# Altium schematic sheet BMS_Circuit.SchDoc
size B
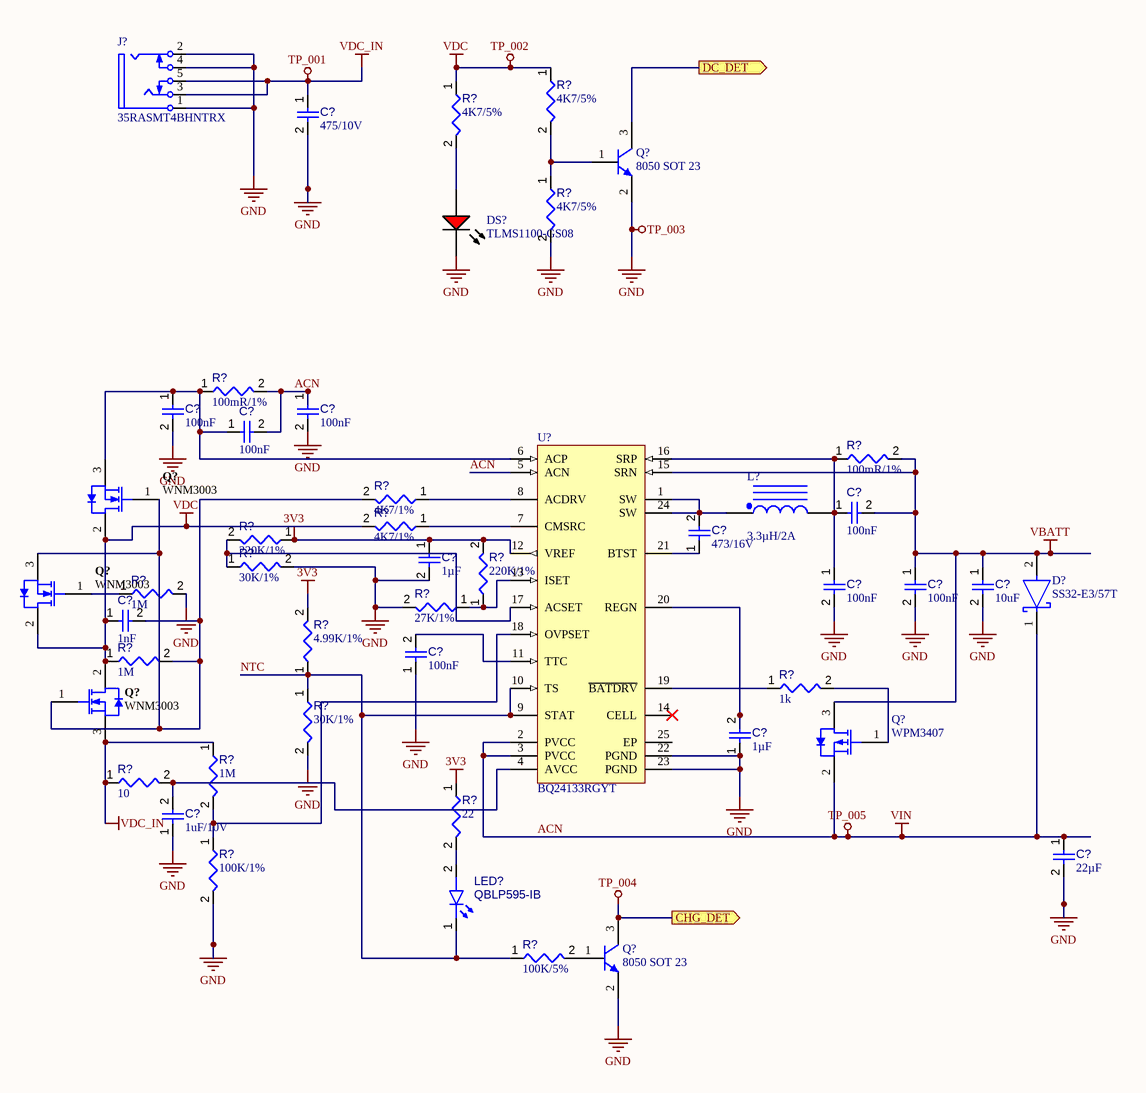
[diagram p0: BMS_Circuit.SchDoc]

## Parts
(Parts that share a designator on the sheet are numbered #1, #2 ... from top to bottom, then left to right.)
C?#1  value 475/10V  [CAPC0402(1005)60_L]  (hidden comment: Capacitor 100nF +/-20% 10V 0402)
C?#2  value 100nF  [CAPC0402(1005)60_L]  (hidden comment: Capacitor 100nF +/-20% 50V 0402)
C?#3  value 100nF  [CAPC0402(1005)60_L]  (hidden comment: Capacitor 100nF +/-20% 50V 0402)
C?#4  value 100nF  [CAPC0402(1005)60_L]  (hidden comment: Capacitor 100nF +/-20% 50V 0402)
C?#5  value 100nF  [CAPC0402(1005)60_L]  (hidden comment: Capacitor 100nF +/-20% 25V 0402)
C?#6  value 1µF  [CAPC1005X55X25ML05T10]  (hidden comment: Capacitor 1 uF +/- 10% 6.3 V 0402)
C?#7  value 473/16V  [CAPC0402(1005)60_L]  (hidden comment: Capacitor 1µF +/-20% 10V 0402)
C?#8  value 100nF  [CAPC0402(1005)60_L]  (hidden comment: Capacitor 100nF +/-20% 10V 0402)
C?#9  value 100nF  [CAPC0402(1005)60_L]  (hidden comment: Capacitor 100nF +/-20% 10V 0402)
C?#10  value 10uF  [CAPC0402(1005)60_L]  (hidden comment: Capacitor 100nF +/-20% 10V 0402)
C?#11  value 1nF  [CAPC0805(2012)145_L]  (hidden comment: Capacitor 100µF +/-20% 6.3V 0805)
C?#12  value 100nF  [CAPC0402(1005)60_L]  (hidden comment: Capacitor 100nF +/-20% 10V 0402)
C?#13  value 1µF  [CAPC0402(1005)60_L]  (hidden comment: Capacitor 1µF +/-20% 10V 0402)
C?#14  value 1uF/10V  [CAPC0402(1005)60_L]  (hidden comment: Capacitor 100nF +/-20% 10V 0402)
C?#15  value 22µF  [CAPC0805(2012)145_L]  (hidden comment: Capacitor 22µF +/-40% 16V 0805)
D?  SS32-E3/57T  [FP-SS32-E3-57T-MFG]
DS?  TLMS1100-GS08  [VISH-TLMX1100_V]
J?  35RASMT4BHNTRX  [SWIT-35RASMT4BHNTRX_V]
L?  Inductance: 3.3µH/2A  [CODA-CSAB0630-100M_V]  (hidden comment: CSAB0630-100M)
LED?  QBLP595-IB  [QTB-QBLP595_V]
Q?#1  8050 SOT 23  [ONSC-SOT-23-3-318-08_V]
Q?#2  WNM3003  [FAIR-TO-251-3]
Q?#3  WNM3003  [FAIR-TO-251-3]
Q?#4  WNM3003  [FAIR-TO-251-3]
Q?#5  WPM3407  [ONSC-SOT-23-3-318-08_V]
Q?#6  8050 SOT 23  [ONSC-SOT-23-3-318-08_V]
R?#1  value 4K7/5%  [RESC1005X40X25ML10T10]  (hidden comment: Resistor 4K7 +/-5% 0402)
R?#2  value 4K7/5%  [RESC1005X40X25ML10T10]  (hidden comment: Resistor 4K7 +/-5% 0402)
R?#3  value 4K7/5%  [RESC1005X40X25ML10T10]  (hidden comment: Resistor 4K7 +/-5% 0402)
R?#4  value 100mR/1%  [RESC0402(1005)_L]  (hidden comment: Resistor 1M +/-5 % 0402 63 mW)
R?#5  value 100mR/1%  [RESC0402(1005)_L]  (hidden comment: Resistor 1M +/-5 % 0402 63 mW)
R?#6  value 4K7/1%  [RESC0402(1005)_L]  (hidden comment: Resistor 2K37 +/-1 % 0402 63 mW)
R?#7  value 4K7/1%  [RESC0402(1005)_L]  (hidden comment: Resistor 2K37 +/-1 % 0402 63 mW)
R?#8  value 220K/1%  [RESC0402(1005)_L]  (hidden comment: Resistor 2K37 +/-1 % 0402 63 mW)
R?#9  value 30K/1%  [RESC0402(1005)_L]  (hidden comment: Resistor 2K37 +/-1 % 0402 63 mW)
R?#10  value 1M  [RESC0402(1005)_L]  (hidden comment: Resistor 1M +/-1 % 0402 63 mW)
R?#11  value 27K/1%  [RESC0402(1005)_L]  (hidden comment: Resistor 2K37 +/-1 % 0402 63 mW)
R?#12  value 220K/1%  [RESC0402(1005)_L]  (hidden comment: Resistor 2K37 +/-1 % 0402 63 mW)
R?#13  value 1M  [RESC0402(1005)_L]  (hidden comment: Resistor 1M +/-1 % 0402 63 mW)
R?#14  value 4.99K/1%  [RESC0402(1005)_L]  (hidden comment: Resistor 2K37 +/-1 % 0402 63 mW)
R?#15  value 30K/1%  [RESC0402(1005)_L]  (hidden comment: Resistor 2K37 +/-1 % 0402 63 mW)
R?#16  value 1k  [RESC0402(1005)_L]  (hidden comment: Resistor 1K +/-5 % 0402 63 mW)
R?#17  value 1M  [RESC0402(1005)_L]  (hidden comment: Resistor 1M +/-5 % 0402 63 mW)
R?#18  value 10  [RESC0402(1005)_L]  (hidden comment: Resistor 10R  +/-1 % 0402 63 mW)
R?#19  value 22  [RESC0402(1005)_L]  (hidden comment: Resistor 22R  +/-5 % 0402 63 mW)
R?#20  value 100K/1%  [RESC0402(1005)_L]  (hidden comment: Resistor 1M +/-5 % 0402 63 mW)
R?#21  value 100K/5%  [RESC0402(1005)_L]  (hidden comment: Resistor 2K37 +/-1 % 0402 63 mW)
U?  BQ24133RGYT  [RGY0024A_V]

## Ports
CHG_DET (out), DC_DET (out)

## Nets
3V3: C?#6.1 R?#8.1 R?#12.2 R?#14.2 R?#19.1 U?.12(VREF)
ACN: C?#3.1 C?#4.2 C?#15.1 D?.1(C) Q?#5.2(SOURCE) R?#4.2 U?.2(PVCC) U?.3(PVCC) U?.5(ACN)  [also labelled TP_005, VIN]
GND: C?#1.2 C?#2.2 C?#3.2 C?#6.2 C?#8.2 C?#9.2 C?#10.2 C?#12.1 C?#13.1 C?#14.1 C?#15.2 DS?.2(K) J?.1 J?.2 J?.4 Q?#1.2(E) Q?#6.2(E) R?#3.2 R?#9.2 R?#10.2 R?#11.2 R?#15.2 R?#20.2 U?.22(PGND) U?.23(PGND)  [also labelled TP_003]
TP_001: C?#1.1 J?.3 J?.5 Q?#4.3(S) R?#17.1 R?#18.1  [also labelled VDC_IN]
TP_002: C?#11.1 Q?#2.2(D) Q?#3.2(D) Q?#4.2(D) R?#1.1 R?#2.1 R?#7.2 R?#13.1  [also labelled VDC]
TP_004: Q?#6.3(C) ; port CHG_DET
VBATT: C?#5.2 C?#9.1 C?#10.1 D?.2(A) Q?#5.3(DRAIN) R?#5.2 U?.15(SRN)
DC_DET: Q?#1.3(C) ; port DC_DET
NTC: LED?.1(K) R?#14.1 R?#15.1 R?#21.1 U?.9(STAT) U?.10(TS)
NetC?#2_1: C?#2.1 C?#4.1 Q?#2.3(S) R?#4.1 U?.6(ACP)
NetC?#5_1: C?#5.1 C?#8.1 L?.2 R?#5.1 U?.16(SRP)
NetC?#7_1: C?#7.1 U?.21(BTST)
NetC?#7_2: C?#7.2 L?.1 U?.1(SW) U?.24(SW)
NetC?#11_2: C?#11.2 Q?#2.1(G) Q?#3.3(S) Q?#4.1(G) R?#6.2 R?#13.2
NetC?#12_2: C?#12.2 U?.11(TTC)
NetC?#13_2: C?#13.2 U?.20(REGN)
NetC?#14_2: C?#14.2 R?#18.2 U?.4(AVCC)
NetDS?_1: DS?.1(A) R?#2.2
NetLED?_2: LED?.2(A) R?#19.2
NetQ?#1_1: Q?#1.1(B) R?#1.2 R?#3.1
NetQ?#3_1: Q?#3.1(G) R?#10.1
NetQ?#5_1: Q?#5.1(GATE) R?#16.2
NetQ?#6_1: Q?#6.1(B) R?#21.2
NetR?#6_1: R?#6.1 U?.8(ACDRV)
NetR?#7_1: R?#7.1 U?.7(CMSRC)
NetR?#8_2: R?#8.2 R?#9.1 U?.17(ACSET)
NetR?#11_1: R?#11.1 R?#12.1 U?.13(ISET)
NetR?#16_1: R?#16.1 U?.19(~{BATDRV})
NetR?#17_2: R?#17.2 R?#20.1 U?.18(OVPSET)

Not connected (* = marked no-connect by the designer): U? 14(CELL)* 25(EP)

## Library data of the parts
C?#1 C?#8-C?#10 C?#12 C?#14 = CMP-001-00061-2: Chip Capacitor, 100nF +/-20%, 10V, 0402, Thickness 0.6 mm; Tolerance: 20%; Min Operating Temperature: -55°C; Case/Package: 0402; Pins: 2; Max Operating Temperature: 85°C; Voltage Rating: 10V; Mounting Technology: SMT
C?#2-C?#4 = CMP-001-00067-2: Chip Capacitor, 100nF +/-20%, 50V, 0402, Thickness 0.6 mm; Tolerance: 10%; Mounting Technology: SMT; Min Operating Temperature: -55°C; Pins: 2; Case/Package: 0402; Voltage Rating: 50V; Max Operating Temperature: 85°C
C?#5 = CMP-001-00065-2: Chip Capacitor, 100nF +/-20%, 25V, 0402, Thickness 0.6 mm; Tolerance: 10%; Pins: 2; Min Operating Temperature: -55°C; Max Operating Temperature: 85°C; Mounting Technology: SMT; Case/Package: 0603; Voltage Rating: 25V
C?#6 = CMP-001-00008-4: Chip Capacitor, 1 uF, +/- 10%, 6.3 V, 0402 (1005 Metric); Voltage Rating: 6.3V; Capacitor Type: Ceramic; Mounting Technology: SM; Min Operating Temperature: -55°C; Pins: 2; Case/Package: 0402; RoHS Compliant: True; Max Operating Temperature: 85°C; Tolerance: 10%
C?#7 C?#13 = CMP-001-00063-2: Chip Capacitor, 1µF +/-20%, 10V, 0402, Thickness 0.6 mm; Tolerance: 10%; Pins: 2; Max Operating Temperature: 85°C; Case/Package: 0402; Voltage Rating: 10V; Mounting Technology: SMT; Min Operating Temperature: -55°C
C?#11 = CMP-001-00054-2: Chip Capacitor, 100µF +/-20%, 6.3V, 0805, Thickness 1.45 mm; Tolerance: 10%; Case/Package: 0402; Min Operating Temperature: -55°C; Max Operating Temperature: 85°C; Pins: 2; Voltage Rating: 6.3V; Mounting Technology: SMT
C?#15 = CMP-001-00081-2: Chip Capacitor, 22µF +/-40%, 16V, 0805, Thickness 1.45 mm; Tolerance: 5%; Min Operating Temperature: -55°C; Mounting Technology: SMT; Case/Package: 0402; Pins: 2; Voltage Rating: 16V; Max Operating Temperature: 85°C
D? = CMP-02539-000003-1: DIODE SCHOTTKY 20V 3A DO214AB; Manufacturer: Vishay; Peak Reverse Current: 0.5mA; Standoff Height: 0mm; Max Junction Temp: +150°C; Max Surge Forward Current: 100A; Mouser Description: Diode; Schottky Barrier; Vr 20V; If 3A; Pkg DO-214AB (SMC); Vf 0.5V; Tj +125degc; Cs 10; Dc Blocking Voltage: 20V; Height: 2.62mm; Forward Current: 3A; Footprint Url: http://www.vishay.com/docs/95402/smc.pdf; RoHS: TRUE; Lead Free: Yes; Max Repetitive Reverse Voltage: 20V; Reverse Voltage: 20V; Octopart: https://octopart.com/ss32-e3%2F57t-vishay-39552901; Package: DO-214AB; Digikey Description: DIODE SCHOTTKY 20V 3A DO214AB; Category: Diode; Device Class L3: Schottky Diodes; Automotive: No; Temperature Range High: +150°C; Device Class L2: Diodes; Temperature Range Low: -55°C; Device Class L1: Discrete Semiconductors; ComponentLink2Description: Datasheet; Temperature: -55°C to +150°C; ComponentLink2URL: http://www.vishay.com/docs/88751/ss32.pdf; Manufacturer Part Number: SS32-E3/57T
DS? = CMP-007-00030-1: Red Led, 20mA, 2.1 V, -40 to 100 degC, 2-Pin SMD (0603), RoHS, Tape and Reel; Manufacturer: Vishay Semiconductor; Forward Voltage: 2.1V; Lens Style: Clear; Luminous Intensity: 63mcd; Power: 90mW; Viewing Angle: 160degrees; Datasheet Version: Rev. 2.7, 03/2016; Package Reference: TLMX1100; Packaging: TapeandReel; Mounting Technology: SM; Illumination Colour: Red; Min Operating Temperature: -40°C; Case/Package: 0603; RoHS Compliant: True; Pins: 2; Max Operating Temperature: 100°C; Datasheet URL: http://www.vishay.com/docs/83173/tlmb1100.pdf; Package Description: 2-Pin Surface Mount Device, Body 1.6 x 0.8 mm; Manufacturer URL: http://www.vishay.com/; Nominal Vf: 2.1V; Colour: Red; Package Quantity: 3000; Forward Current: 20mA
J? = CMP-002-00007-1: Female 3.5 mm Phone Jack, 5 Position, Height 5 mm, RoHS, Tape and Reel; Manufacturer: Switchcraft; Current Rating: 3A; Voltage Rating: 250V; Shielding: Unshielded; Connector Type: Audio; Gender: Female; Manufacturer URL: http://www.switchcraft.com/; Package Reference: 35RASMT4BHNTRX; Case/Package: 35RASMT4BHNTRX; Contact Plating: Silver; Colour: Black; Min Operating Temperature: -25°C; Max Current Rating: 3A; Contact Material: Copper; Datasheet URL: http://www.switchcraft.com/Drawings/35rasmt4bhntrx_cd.pdf; Mounting Technology: SM; Datasheet Version: Rev. C, 07/2014; Package Description: Female 3.5 mm Phone Jack, 5 Position, Height 5 mm; Package Quantity: 800; Pins: 3; Packaging: TapeandReel; RoHS Compliant: True; Max Operating Temperature: 85°C
L? = CMP-006-00001-2: Molded Inductor, 10 uH, +/- 20%, 77.2 mOhm, -55 to 125 degC, 2-Pin SMD, RoHS, Tape and Reel; Manufacturer: Shenzhen Codaca; Tolerance: 20%; Mounting Technology: SM; Datasheet URL: http://www.murata.com/products/catalog/pdf/c31e.pdf; Package Description: 2-Pin Surface Mount Device, Body 6 x 6 mm; Case/Package: CSAB0630-100M; RoHS Compliant: Unknown; Package Reference: CSAB0630-100M; Manufacturer URL: www.codaca.com.cn; Datasheet Version: Mar-14
LED? = CMP-007-00042-2: Chip LED 0402, Blue, 0.02 A, 3.1 to 3.7 V, -40 to 80 degC, 2-Pin SMD, RoHS, Tape and Reel; Mounting Technology: SMT; Colour: Blue; RoHS Compliant: Yes; Pins: 2; Case/Package: 0402
Q?#1 Q?#6 = CMP-1048-00662-1: High Voltage Transistor, NPN Silicon, 3-Pin SOT-23, Pb-Free, Tape and Reel; PartNumber: MMBTA42LT1G; Manufacturer: On Semiconductor; fT Min (MHz): 50; IC Continuous (A): 0.5; ComponentLink1URL: http://www.onsemi.com/; ComponentLink3URL: http://www.onsemi.cn/pub_link/Collateral/318-08.PDF; RoHS: TRUE; ComponentLink2Description: Datasheet; Polarity: NPN; DatasheetVersion: Rev. 12; PackageReference: SOT-23-3-318-08; PackageDescription: 3-Pin Small Outline Transistor, Body 2.92 x 1.3 mm, Pitch 0.95 mm; ComponentLink3Description: Package Specification; ComponentLink1Description: Manufacturer URL; Packing: Tape and Reel; PackageVersion: Rev. AP, 11/2009; Mounting Technology: Surface Mount; ComponentLink2URL: http://www.onsemi.cn/pub_link/Collateral/MMBTA42LT1-D.PDF
Q?#2-Q?#4 = CMP-013-00024-2: N-Channel QFET(R) MOSFET, 11 A, 60 V, 115 mOhm, -55 to 150 degC, 3-Pin TO-251, RoHS, Tube; Manufacturer: Fairchild; Input Capacitance: 350pF; Typical Rise Time: 90ns; Power: 2.5W; Elements: 1; Mounting Technology: TH; Pins: 3; RoHS Compliant: True; Packaging: Rail/Tube; Datasheet Version: Rev. 1.7, 07/2016; Package Quantity: 70; Datasheet URL: https://www.fairchildsemi.com/datasheets/FQ/FQU13N06L.pdf; Package Reference: TO-251-3; Case/Package: TO-251-3; Min Operating Temperature: -55°C; Max Operating Temperature: 150°C; Package Description: 3-Pin Flange Mount, Body 6.575 x 2.3 mm, Pitch 2.29 mm; Rds On Max: 115mohm
Q?#5 = CMP-013-00012-2: Power MOSFET Single P-Channel, -50 V, 10 Ohm, 3-Pin SOT-23, Pb-Free, Tape and Reel; Manufacturer: ON Semiconductor; Input Capacitance: 30pF; Nominal Vgs: -10V; Nominal Dual Supply Voltage: 5V; Power: 225mW; Elements: 1; Rds On Max: 10Ohm; Typical Rise Time: 1ns; Case/Package: SOT-23-3; Mounting Technology: SM; Max Operating Temperature: 150°C; Packaging: TapeandReel; Pins: 3; Datasheet Version: Rev. 9, 10/2016; Package Description: 3-Pin Small Outline Transistor, Body 2.9 x 1.3 mm, Pitch 0.95 mm; Datasheet URL: http://www.onsemi.com/pub_link/Collateral/BSS84LT1-D.PDF; Package Quantity: 3000; RoHS Compliant: True; Package Reference: SOT-23 (318-08); Min Operating Temperature: -55°C
R?#1-R?#3 = CMP-009-00020-4: Chip Resistor, 4K7 Ohm, +/- 5%, 0.063 W, -55 to 155 degC, 0402 (1005 Metric); Power: 63mW; Min Operating Temperature: -55°C; Tolerance: 5%; Pins: 2; RoHS Compliant: True; Max Operating Temperature: 155°C; Case/Package: 0402; Mounting Technology: SM
R?#4 R?#5 R?#17 R?#20 = CMP-009-00151-2: Chip Resistor, 1 MOhms, +/-5 %, 63 mW, -55 to 155 degC, 0402; Power: 63mW; Tolerance: 5%; Min Operating Temperature: -55°C; Max Operating Temperature: 155°C; Pins: 2; Case/Package: 0402
R?#6-R?#9 R?#11 R?#12 R?#14 R?#15 R?#21 = CMP-009-00162-2: Chip Resistor, 2,37 kOhms, +/-1 %, 63 mW, -55 to 155 degC, 0402; Tolerance: 1%; Power: 63mW; Pins: 2; Min Operating Temperature: -55°C; Case/Package: 0402; Max Operating Temperature: 155°C
R?#10 R?#13 = CMP-009-00165-2: Chip Resistor, 1 MOhms, +/-1 %, 63 mW, -55 to 155 degC, 0402; Tolerance: 1%; Power: 63mW; Case/Package: 0402; Pins: 2
R?#16 = CMP-009-00157-2: Chip Resistor, 1 kOhms, +/-5 %, 63 mW, -55 to 155 degC, 0402; Power: 63mW; Tolerance: 5%; Min Operating Temperature: -55°C; Max Operating Temperature: 155°C; Pins: 2; Case/Package: 0402
R?#18 = CMP-009-00152-2: Chip Resistor, 10 Ohms, +/-1 %, 63 mW, -55 to 155 degC, 0402; Power: 63mW; Tolerance: 1%; Min Operating Temperature: -55°C; Pins: 2; Max Operating Temperature: 155°C; Case/Package: 0402
R?#19 = CMP-009-00164-2: Chip Resistor, 22 Ohms, +/-5 %, 63 mW, -55 to 155 degC, 0402; Tolerance: 5%; Power: 63mW; Max Operating Temperature: 155°C; Case/Package: 0402; Pins: 2; Min Operating Temperature: -55°C
U? = CMP-0321-00108-2: Synchronous Switch-Mode Li-Ion and Li-Polymer Stand-Alone Battery Charger, -40 to 85 degC, 24-pin VQFN (RGY), Green (RoHS & no Sb/Br); Manufacturer: Texas Instruments; Li-Polymer: N; SubFamily: Battery Charge Management; ComponentLink1URL: http://www.ti.com/general/docs/lit/getliterature.tsp?genericPartNumber=BQ24133&fileType=pdf; Over Voltage Protection: N; Code_JEDEC: MO-241-BA; Li-Ion: N; ComponentLink1Description: Datasheet; NiCd: N; NiMH: N; Lead Acid: N; PackageDescription: 24-Leads Plastic Quad Flatpack No-Lead, 5.5 x 3.5 x 0.9 mm Body, 0.5 mm Pitch, Exposed Pad; PackageVersion: revI, Jun-2011; Mounting Technology: Surface Mount; PartNumber: BQ24133RGYT; Eco-Plan: Green (RoHS & no Sb/Br); DatasheetVersion: SLUSAF7B; PackageReference: RGY0024A